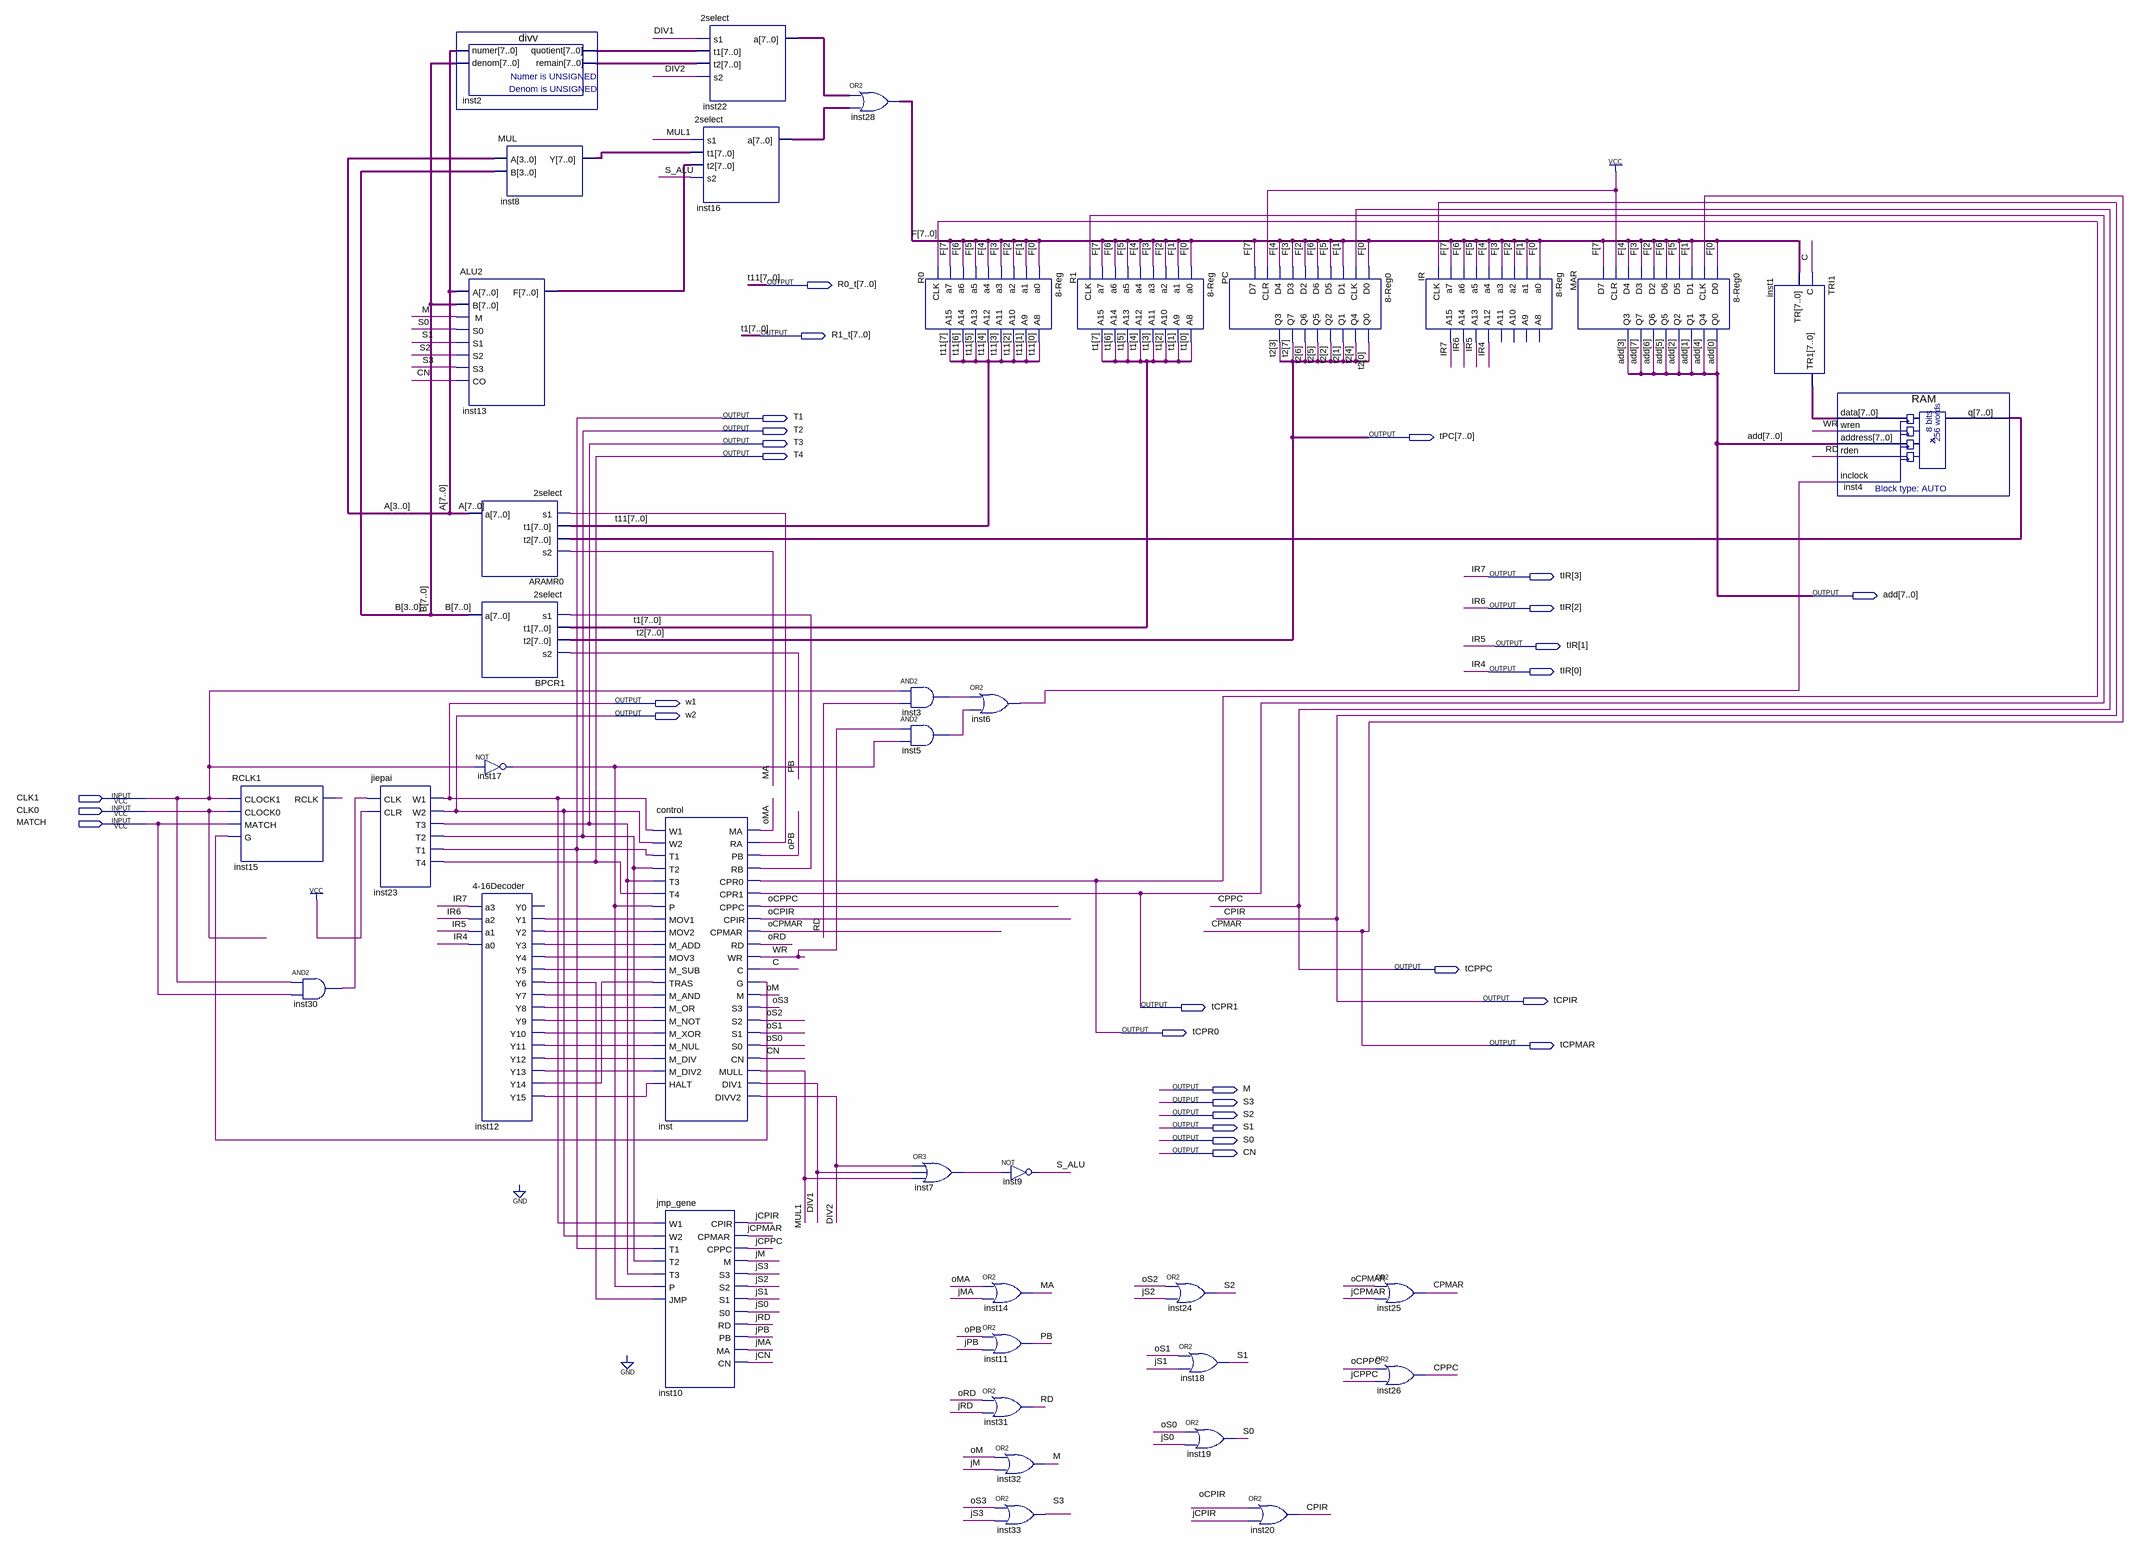
[diagram p0: schematic sheet]
// Quartus schematic EX4.bdf as structural Verilog: 38 symbols, 28 pins
module EX4 (
  input  CLK1,
  input  CLK0,
  input  MATCH,
  output [7:0] R0_t,
  output [7:0] R1_t,
  output T1,
  output T2,
  output [7:0] tPC,
  output T3,
  output T4,
  output [3:0] tIR,
  output [7:0] add,
  output w1,
  output w2,
  output tCPPC,
  output tCPIR,
  output tCPR1,
  output tCPR0,
  output tCPMAR,
  output M,
  output S3,
  output S2,
  output S1,
  output S0,
  output CN
);

  wire C, DIV1, DIV2, inst3_out, inst5_out, inst6_out, inst7_out, inst12_y1, inst12_y2, inst12_y3, inst12_y4,
       inst12_y5, inst12_y6, inst12_y7, inst12_y8, inst12_y9, inst12_y10, inst12_y11, inst12_y12, inst12_y13,
       inst12_y14, inst12_y15, inst15_rclk, inst17_out, inst30_out, inst_g, inst_ra, inst_rb, jCN, jCPIR,
       jCPMAR, jCPPC, jM, jMA, jPB, jRD, jS0, jS1, jS2, jS3, MA, MUL1, oCPIR, oCPMAR, oCPPC, oM, oMA, oPB,
       oRD, oS0, oS1, oS2, oS3, PB, RD, S_ALU, WR;
  wire [7:0] A, B, F, inst1_tr1, inst2_quotient, inst2_remain, inst4_q, inst8_y, inst13_f, inst16_a, inst22_a;

  RCLK1 inst15 (.CLOCK1(CLK1), .CLOCK0(CLK0), .MATCH(MATCH), .G(inst_g), .RCLK(inst15_rclk));
  and inst30 (inst30_out, CLK1, MATCH);
  jiepai inst23 (.CLK(inst30_out), .CLR(1'b1), .W1(w1), .W2(w2), .T3(T3), .T2(T2), .T1(T1), .T4(T4));
  divv inst2 (.numer(A), .denom(B), .quotient(inst2_quotient), .remain(inst2_remain));
  ALU2 inst13 (.A(A), .B(B), .M(M), .S0(S0), .S1(S1), .S2(S2), .S3(S3), .CO(CN), .F(inst13_f));
  MUL inst8 (.A(A[3:0]), .B(B[3:0]), .Y(inst8_y));
  \2select  ARAMR0 (.s1(inst_ra), .t1(R0_t), .t2(inst4_q), .s2(MA), .a(A));
  \2select  BPCR1 (.s1(inst_rb), .t1(R1_t), .t2(tPC), .s2(PB), .a(B));
  not inst17 (inst17_out, CLK1);
  \4-16Decoder  inst12 (
    .a3(tIR[3]), .a2(tIR[2]), .a1(tIR[1]), .a0(tIR[0]), .Y1(inst12_y1), .Y2(inst12_y2), .Y3(inst12_y3),
    .Y4(inst12_y4), .Y5(inst12_y5), .Y6(inst12_y6), .Y7(inst12_y7), .Y8(inst12_y8), .Y9(inst12_y9),
    .Y10(inst12_y10), .Y11(inst12_y11), .Y12(inst12_y12), .Y13(inst12_y13), .Y14(inst12_y14), .Y15(inst12_y15));  // open: Y0
  control inst (
    .W1(w1), .W2(w2), .T1(T1), .T2(T2), .T3(T3), .T4(T4), .P(inst17_out), .MOV1(inst12_y1), .MOV2(inst12_y2),
    .M_ADD(inst12_y3), .MOV3(inst12_y4), .M_SUB(inst12_y5), .TRAS(inst12_y14), .M_AND(inst12_y7),
    .M_OR(inst12_y8), .M_NOT(inst12_y9), .M_XOR(inst12_y10), .M_NUL(inst12_y11), .M_DIV(inst12_y12),
    .M_DIV2(inst12_y13), .HALT(inst12_y15), .MA(oMA), .RA(inst_ra), .PB(oPB), .RB(inst_rb), .CPR0(tCPR0),
    .CPR1(tCPR1), .CPPC(oCPPC), .CPIR(oCPIR), .CPMAR(oCPMAR), .RD(oRD), .WR(WR), .C(C), .G(inst_g), .M(oM),
    .S3(oS3), .S2(oS2), .S1(oS1), .S0(oS0), .CN(CN), .MULL(MUL1), .DIV1(DIV1), .DIVV2(DIV2));
  jmp_gene inst10 (
    .W1(w1), .W2(w2), .T1(T1), .T2(T2), .T3(T3), .P(inst17_out), .JMP(inst12_y6), .CPIR(jCPIR),
    .CPMAR(jCPMAR), .CPPC(jCPPC), .M(jM), .S3(jS3), .S2(jS2), .S1(jS1), .S0(jS0), .RD(jRD), .PB(jPB),
    .MA(jMA), .CN(jCN));
  \2select  inst22 (.s1(DIV1), .t1(inst2_quotient), .t2(inst2_remain), .s2(DIV2), .a(inst22_a));
  \2select  inst16 (.s1(MUL1), .t1(inst8_y), .t2(inst13_f), .s2(S_ALU), .a(inst16_a));
  assign F = inst22_a | inst16_a;  // OR2 inst28, 8 bits wide
  \8-Reg  R0 (
    .a0(F[0]), .a1(F[1]), .a2(F[2]), .a3(F[3]), .a4(F[4]), .a5(F[5]), .a6(F[6]), .a7(F[7]), .CLK(tCPR0),
    .A8(R0_t[0]), .A9(R0_t[1]), .A10(R0_t[2]), .A11(R0_t[3]), .A12(R0_t[4]), .A13(R0_t[5]), .A14(R0_t[6]),
    .A15(R0_t[7]));
  and inst3 (inst3_out, CLK1, RD);
  and inst5 (inst5_out, WR, inst17_out);
  or inst7 (inst7_out, DIV2, DIV1, MUL1);
  or inst6 (inst6_out, inst3_out, inst5_out);
  not inst9 (S_ALU, inst7_out);
  or inst14 (MA, oMA, jMA);
  or inst11 (PB, oPB, jPB);
  or inst31 (RD, oRD, jRD);
  or inst32 (M, oM, jM);
  or inst33 (S3, oS3, jS3);
  \8-Reg  R1 (
    .a0(F[0]), .a1(F[1]), .a2(F[2]), .a3(F[3]), .a4(F[4]), .a5(F[5]), .a6(F[6]), .a7(F[7]), .CLK(tCPR1),
    .A8(R1_t[0]), .A9(R1_t[1]), .A10(R1_t[2]), .A11(R1_t[3]), .A12(R1_t[4]), .A13(R1_t[5]), .A14(R1_t[6]),
    .A15(R1_t[7]));
  or inst24 (S2, oS2, jS2);
  \8-Reg0  PC (
    .D0(F[0]), .CLK(tCPPC), .D1(F[1]), .D5(F[5]), .D6(F[6]), .D2(F[2]), .D3(F[3]), .D4(F[4]), .CLR(1'b1),
    .D7(F[7]), .Q0(tPC[0]), .Q4(tPC[4]), .Q1(tPC[1]), .Q2(tPC[2]), .Q5(tPC[5]), .Q6(tPC[6]), .Q7(tPC[7]),
    .Q3(tPC[3]));
  or inst18 (S1, oS1, jS1);
  or inst19 (S0, oS0, jS0);
  or inst20 (tCPIR, oCPIR, jCPIR);
  or inst25 (tCPMAR, oCPMAR, jCPMAR);
  or inst26 (tCPPC, oCPPC, jCPPC);
  \8-Reg  IR (
    .a0(F[0]), .a1(F[1]), .a2(F[2]), .a3(F[3]), .a4(F[4]), .a5(F[5]), .a6(F[6]), .a7(F[7]), .CLK(tCPIR),
    .A12(tIR[0]), .A13(tIR[1]), .A14(tIR[2]), .A15(tIR[3]));  // open: A8, A9, A10, A11
  \8-Reg0  MAR (
    .D0(F[0]), .CLK(tCPMAR), .D1(F[1]), .D5(F[5]), .D6(F[6]), .D2(F[2]), .D3(F[3]), .D4(F[4]), .CLR(1'b1),
    .D7(F[7]), .Q0(add[0]), .Q4(add[4]), .Q1(add[1]), .Q2(add[2]), .Q5(add[5]), .Q6(add[6]), .Q7(add[7]),
    .Q3(add[3]));
  TRI1 inst1 (.C(C), .TR(F), .TR1(inst1_tr1));
  RAM inst4 (.data(inst1_tr1), .wren(WR), .address(add), .rden(RD), .inclock(inst6_out), .q(inst4_q));

  // Other names for the same wires on the sheet: CPIR = tCPIR; CPMAR = tCPMAR; CPPC = tCPPC; IR4 = tIR[0];
  //   IR5 = tIR[1]; IR6 = tIR[2]; IR7 = tIR[3]; T1[7:0] = R1_t; t11[7:0] = R0_t; T2[7:0] = tPC
endmodule
